# Altium schematic sheet [07] - CPU CONNECTORS .SchDoc (part 2 of 2)
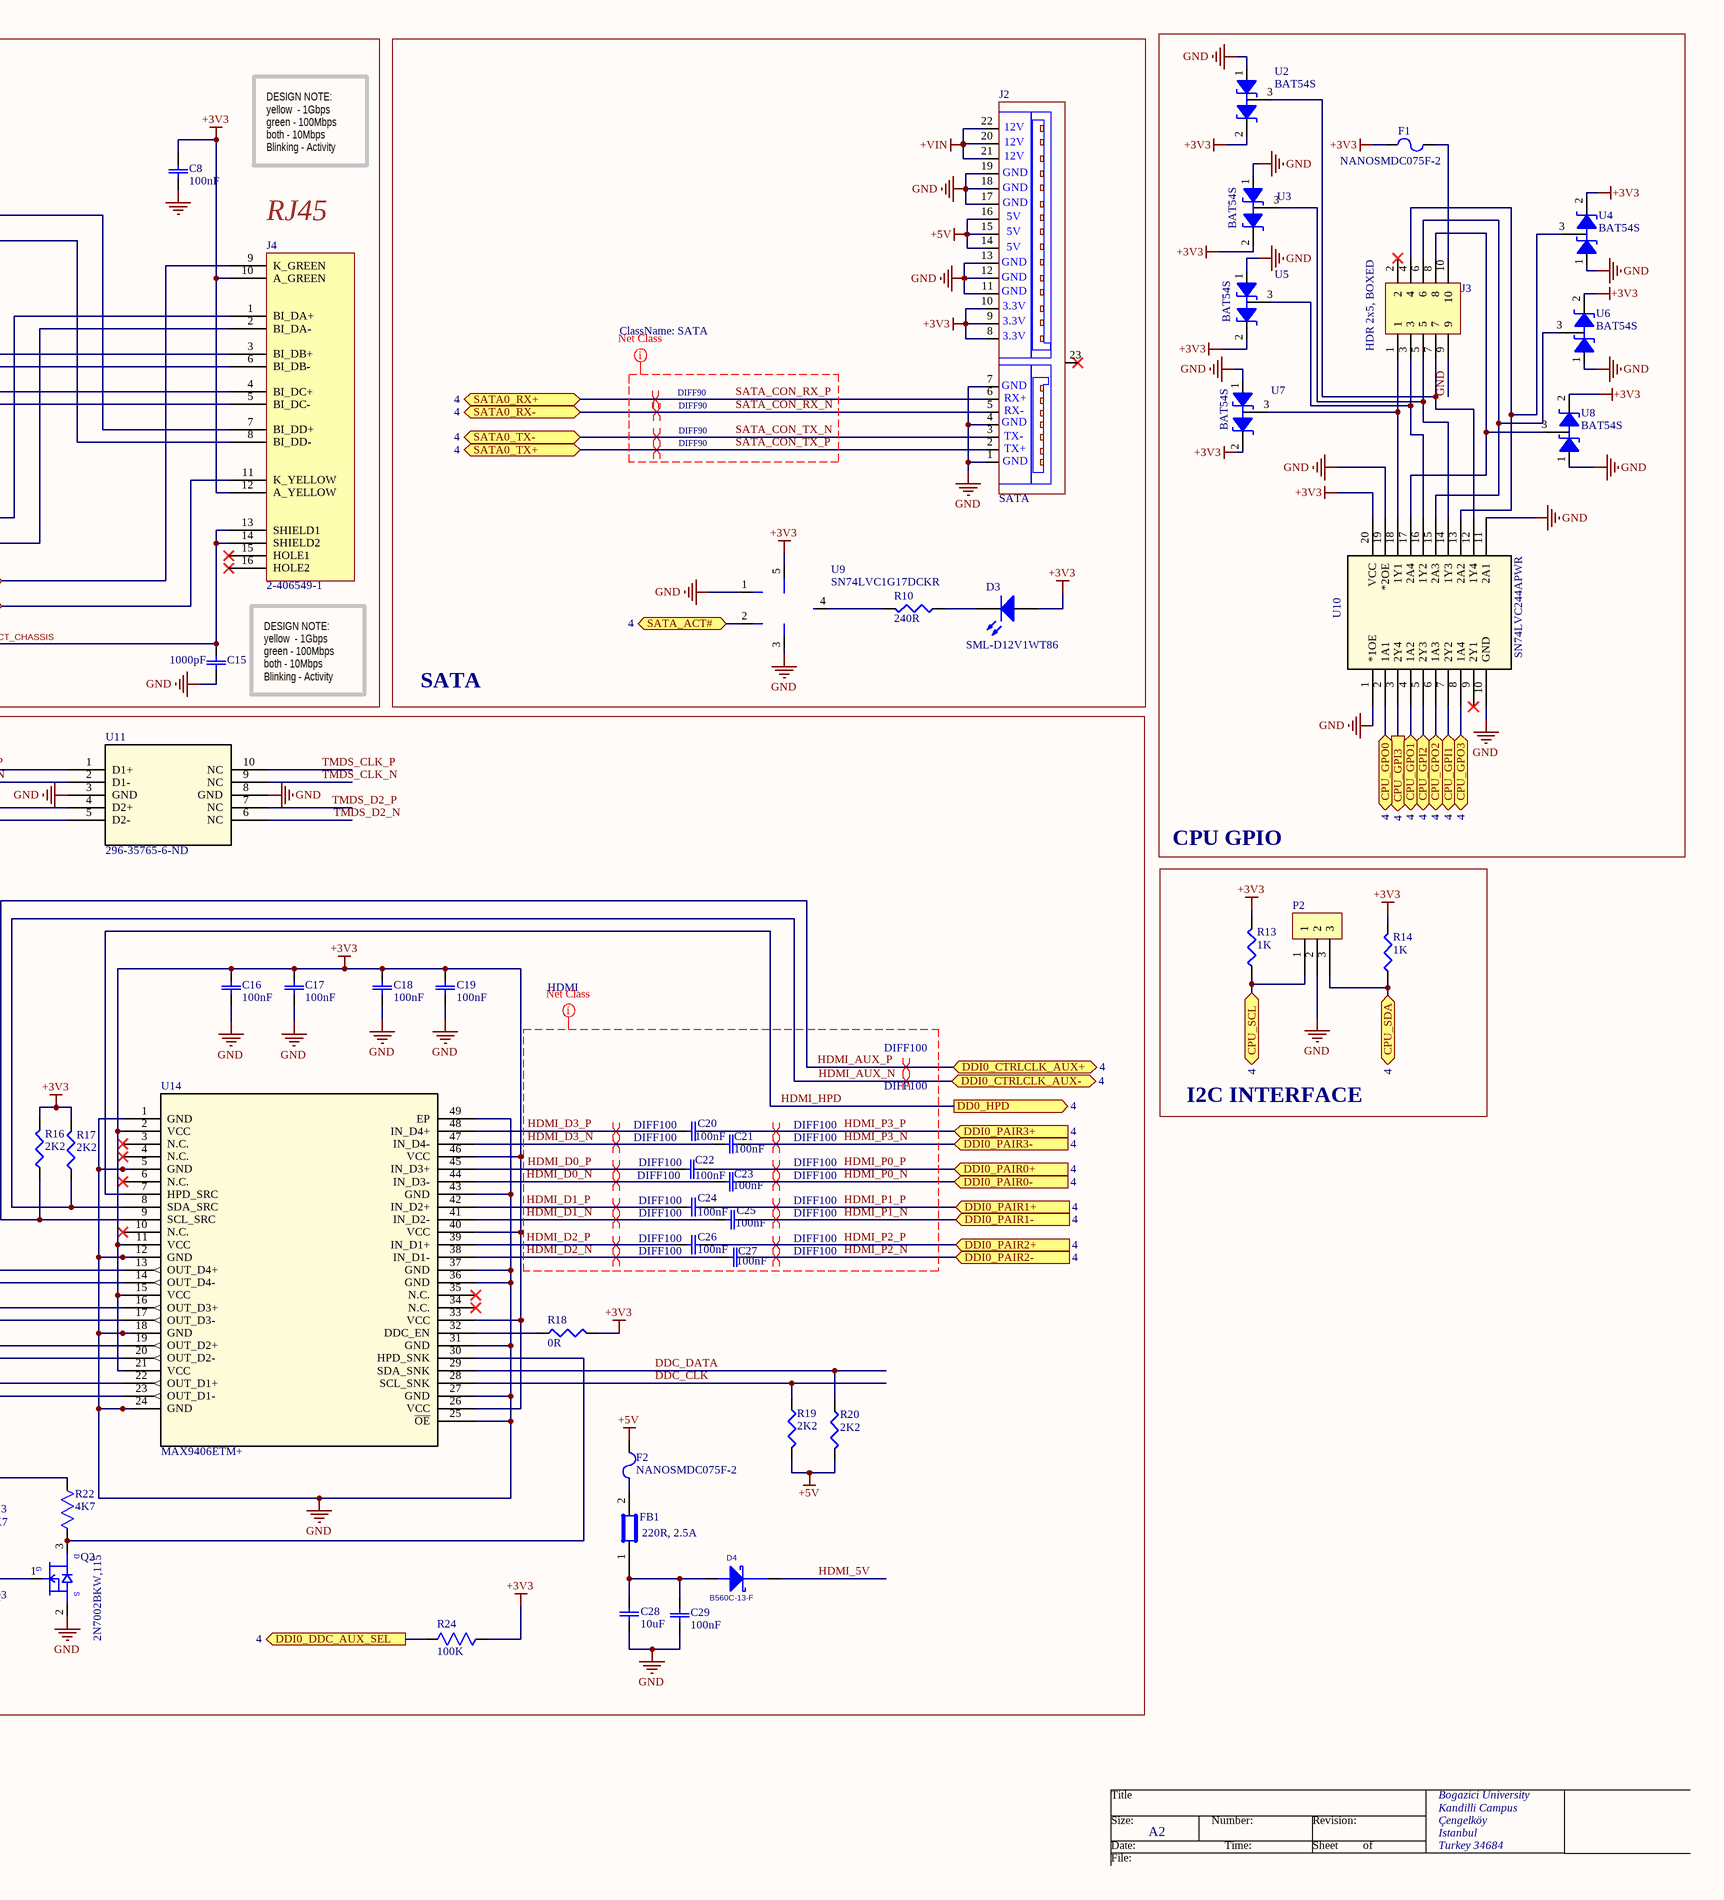
[diagram p2: [07] - CPU CONNECTORS .SchDoc, right]

## Library data of the parts
BT1 = CR2032: BATTERY HOLDER COIN 20MM PC PIN; Product Training Modules: Battery Holders for Wireless Applications; Featured Product: Top and Side Loading Coin Cell Holders Ultra-Low CR2016 Coin Cell Holder Covered 8-AA Battery Pack Cylindrical Battery Contacts; Battery Type, Function: Coin Cell, Holder; Style: Holder (Open); Number of Cells: 1; Battery Series: 2032; Online Catalog: Battery Holders, Clips, Contacts; For Use With: P188-ND / - BATTERY LITHIUM 3V COIN 20MM / P138-ND / - BATTERY LITHIUM 3V COIN 20MM / P189-ND / - BATTERY LITHIUM 3V COIN 20MM / N138-ND / - BATTERY LITHIUM 3V COIN 20MM / N188-ND / - BATTERY LITHIUM 3V COIN 20MM / P186-ND / - BATTERY LITHIUM 3V COIN 20MM / SY189-ND / - BATTERY LITHIUM 3V COIN 20MM / SY138-ND / - BATTERY LITHIUM 3V COIN 20MM / SY188-ND / - BATTERY LITHIUM 3V COIN 20MM / N189-ND / - BATTERY LITHIUM 3V COIN 20MM / P037-ND / - BATTERY LITHIUM 3V COIN 20MM / N037-ND / - BATTERY LITHIUM 3V COIN 20MM / ECR2032BP-ND / - BATTERY LITH 3V COIN 20MM; Other Names: BS7; .Checked SCH: CHK; Supplier 1: Electro Sonic; Supplier Part Number 1: BS7; Manufacturer Part Number: BS-7; Manufacturer 2: Memory Protection Devices; Manufacturer Part Number 2: BS-7; Stock 2: 0; RoHS Information: Cert of Compliance; Standard Package: 100; Family: Battery Holders, Clips, Contacts; Battery Cell Size: Coin, 20.0mm; Mounting Type: PCB, Through Hole; Termination Style: PC Pin; Height Above Board: 0.354" (9.00mm); Operating Temperature: -55°C ~ 105°C; ComponentLink1URL: http://www.memoryprotectiondevices.com/datasheets/BS-7-datasheet.pdf?src-supplier=Digi-Key; ComponentLink1Description: http://www.memoryprotectiondevices.com/datasheets/BS-7-datasheet.pdf?src-supplier=Digi-Key; Supplier 2: Perfect Parts; Supplier Part Number 2: BS-7; Description 2: BATTERY HOLDER COIN 20MM PC PIN; Category: Battery Products; .Checked PCB: CHK
C8 C13 = CL05A104KA5NNNC: CAP CER 0.1UF 50V X8R 0603; Manufacturer 1: Samsung Electro-Mechanics; Tolerance: ±10%; Voltage - Rated: 25V; Temperature Coefficient: X5R; Notification: Current market demand for these product types have resulted in fluctuating and extending lead times. Lead times may differ.; Description 1: CAP CER 0.1UF 25V X5R 0402; .Checked PCB: USED; Manufacturer Part Number 1: CL05A104KA5NNNC; RoHS: RoHS Compliant; Stock 1: 100000; Pricing 1: 1=0.1, 10=0.04, 100=0.0176, 500=0.0126, 1000=0.0099, 2500=0.009, 5000=0.00828 (USD); Packaging: Digi-Reel®; Part Status: Active; Operating Temperature: -55°C ~ 85°C; Features: -; Ratings: -; Applications: General Purpose; Mounting Type: Surface Mount, MLCC; Package / Case: 0402 (1005 Metric); Size / Dimension: 0.039" L x 0.020" W (1.00mm x 0.50mm); Height - Seated (Max): -; Thickness (Max): 0.022" (0.55mm); Lead Spacing: -; Lead Style: -; Supplier 1: Digi-Key; Supplier Part Number 1: 1276-1043-6-ND; Category: Capacitors; ComponentLink1URL: http://www.samsungsem.com/kr/support/product-search/mlcc/CL05A104KA5NNNC.jsp; ComponentLink1Description: http://www.samsungsem.com/kr/support/product-search/mlcc/CL05A104KA5NNNC.jsp; .Checked SCH: USED
C9-C12 C16-C19 = CL05A104KA5NNNC: CAP CER 0.1UF 25V X5R 0402; Manufacturer 1: Samsung Electro-Mechanics; Tolerance: ±10%; Notification: Current market demand for these product types have resulted in fluctuating and extending lead times. Lead times may differ.; .Checked SCH: CHK; Manufacturer Part Number 1: CL05A104KA5NNNC; RoHS: RoHS Compliant; Stock 1: 100000; Pricing 1: 1=0.1, 10=0.04, 100=0.0176, 500=0.0126, 1000=0.0099, 2500=0.009, 5000=0.00828 (USD); Packaging: Digi-Reel®; Part Status: Active; Voltage - Rated: 25V; Temperature Coefficient: X5R; Operating Temperature: -55°C ~ 85°C; Features: -; Ratings: -; Applications: General Purpose; Mounting Type: Surface Mount, MLCC; Package / Case: 0402 (1005 Metric); Size / Dimension: 0.039" L x 0.020" W (1.00mm x 0.50mm); Height - Seated (Max): -; Thickness (Max): 0.022" (0.55mm); Lead Spacing: -; Lead Style: -; Supplier 1: Digi-Key; Supplier Part Number 1: 1276-1043-6-ND; Description 1: CAP CER 0.1UF 25V X5R 0402; Category: Capacitors; ComponentLink1URL: http://www.samsungsem.com/kr/support/product-search/mlcc/CL05A104KA5NNNC.jsp; ComponentLink1Description: http://www.samsungsem.com/kr/support/product-search/mlcc/CL05A104KA5NNNC.jsp
C14 C15 = C1206X102KGRACAUTO: CAP CER 1206 1NF 2000V X7R 10% F; Manufacturer 1: KEMET; Voltage - Rated: 2000V (2kV); .Checked PCB: USED; Category: Capacitors; Operating Temperature: -55°C ~ 125°C; Package / Case: 1206 (3216 Metric); Supplier 1: Digi-Key; Supplier Part Number 1: 399-16730-1-ND; RoHS: RoHS Compliant; Stock 1: 7503; Pricing 1: 1=0.79, 10=0.58, 100=0.3974, 500=0.31464, 1000=0.26496 (USD); Tolerance: ±10%; Temperature Coefficient: X7R; Mounting Type: Surface Mount, MLCC; Applications: Automotive, Boardflex Sensitive; Ratings: AEC-Q200; Size / Dimension: 0.130" L x 0.063" W (3.30mm x 1.60mm); Height - Seated (Max): -; Thickness (Max): 0.073" (1.85mm); Lead Spacing: -; Features: Low ESL, Soft Termination, High Voltage; Packaging: Cut Tape (CT); Lead Style: -; ComponentLink1URL: https://api.kemet.com/component-edge/download/datasheet/C1206X102KGRACAUTO.pdf; ComponentLink1Description: https://api.kemet.com/component-edge/download/datasheet/C1206X102KGRACAUTO.pdf; Manufacturer Part Number 1: C1206X102KGRACAUTO; Part Status: Active; Failure Rate: -; Description 1: CAP CER 1206 1NF 2000V X7R 10% F; .Checked SCH: USED
C20-C27 = C1608X8R1H104K08: CAP CER 0.1UF 25V X5R 0402; Manufacturer_Part_Number: C1608X8R1H104K080AB; Manufacturer 1: TDK Corporation; Vendor: TDK; Built_By: EMA_UL_Team; Type: DEV; C: Copyright (C) 2015 Accelerated Designs. All rights reserved; Tolerance: ±10%; Voltage - Rated: 50V; Temperature Coefficient: X8R; Notification: Current market demand for these product types have resulted in fluctuating and extending lead times. Lead times may differ.; Description 1: CAP CER 0.1UF 50V X8R 0603; .Checked SCH: CHK; RefDes: RefDes; Value: Value; Manufacturer Part Number 1: C1608X8R1H104K080AB; RoHS: RoHS Compliant; Stock 1: 5228; Pricing 1: 1=0.32, 10=0.216, 100=0.1093, 500=0.07476, 1000=0.06613 (USD); Packaging: Cut Tape (CT); Part Status: Active; Operating Temperature: -55°C ~ 150°C; Features: High Temperature; Ratings: -; Applications: General Purpose; Failure Rate: -; Mounting Type: Surface Mount, MLCC; Package / Case: 0603 (1608 Metric); Size / Dimension: 0.063" L x 0.032" W (1.60mm x 0.80mm); Height - Seated (Max): -; Thickness (Max): 0.035" (0.90mm); Lead Spacing: -; Lead Style: -; Supplier 1: Digi-Key; Supplier Part Number 1: 445-8818-1-ND; Category: Capacitors
C28 = C3216JB1V106K160: CAP CER 10UF 35V JB 1206; Manufacturer_Part_Number: C3216JB1V106K160AB; Manufacturer 1: TDK Corporation; Tolerance: ±10%; Vendor: TDK; Built_By: EMA_UL_Team; Type: DEV; C: Copyright (C) 2015 Accelerated Designs. All rights reserved; Notification: Current market demand for these product types have resulted in fluctuating and extending lead times. Lead times may differ.; .Checked SCH: CHK; Category: Capacitors; Operating Temperature: -25°C ~ 85°C; Package / Case: 1206 (3216 Metric); Value: Value; Voltage - Rated: 35V; Features: Low ESL; Supplier 1: Digi-Key; Supplier Part Number 1: 445-11736-1-ND; RoHS: RoHS Compliant; Stock 1: 5285; Pricing 1: 1=0.92, 10=0.648, 100=0.4269, 500=0.31626, 1000=0.26881 (USD); Temperature Coefficient: JB; Mounting Type: Surface Mount, MLCC; Applications: General Purpose; Ratings: -; Size / Dimension: 0.126" L x 0.063" W (3.20mm x 1.60mm); Height - Seated (Max): -; Thickness (Max): 0.069" (1.75mm); Lead Spacing: -; Packaging: Cut Tape (CT); Lead Style: -; ComponentLink1URL: https://product.tdk.com/info/en/catalog/datasheets/mlcc_commercial_general_en.pdf; ComponentLink1Description: https://product.tdk.com/info/en/catalog/datasheets/mlcc_commercial_general_en.pdf; RefDes: RefDes; Manufacturer Part Number 1: C3216JB1V106K160AB; Part Status: Active; Failure Rate: -; Description 1: CAP CER 10UF 35V JB 1206
C29 = CL05A104KA5NNNC: CAP CER 0.1UF 50V X8R 0603; Manufacturer 1: Samsung Electro-Mechanics; Voltage - Rated: 25V; Tolerance: ±10%; Temperature Coefficient: X5R; Notification: Current market demand for these product types have resulted in fluctuating and extending lead times. Lead times may differ.; Description 1: CAP CER 0.1UF 25V X5R 0402; .Checked SCH: CHK; Category: Capacitors; Operating Temperature: -55°C ~ 85°C; Package / Case: 0402 (1005 Metric); Supplier 1: Digi-Key; Supplier Part Number 1: 1276-1043-6-ND; RoHS: RoHS Compliant; Stock 1: 100000; Pricing 1: 1=0.1, 10=0.04, 100=0.0176, 500=0.0126, 1000=0.0099, 2500=0.009, 5000=0.00828 (USD); Mounting Type: Surface Mount, MLCC; Applications: General Purpose; Ratings: -; Size / Dimension: 0.039" L x 0.020" W (1.00mm x 0.50mm); Height - Seated (Max): -; Thickness (Max): 0.022" (0.55mm); Lead Spacing: -; Features: -; Packaging: Digi-Reel®; Lead Style: -; ComponentLink1URL: http://www.samsungsem.com/kr/support/product-search/mlcc/CL05A104KA5NNNC.jsp; ComponentLink1Description: http://www.samsungsem.com/kr/support/product-search/mlcc/CL05A104KA5NNNC.jsp; Manufacturer Part Number 1: CL05A104KA5NNNC; Part Status: Active
D3 = SML-D12V1WT86: LED RED DIFFUSED 1608 SMD; Manufacturer 1: Rohm Semiconductor; Lens Color: White; Millicandela Rating: 40mcd; Lens Style/Size: Rectangle with Flat Top, 1.20mm x 0.80mm; Voltage - Forward (Vf) (Typ): 2.2V; Current - Test: 20mA; Wavelength - Dominant: 630nm; .Checked SCH: CHK; Manufacturer Part Number 1: SML-D12V1WT86; Stock 1: 3000; Pricing 1: 3000=0.0245, 6000=0.023, 12000=0.0217, 18000=0.0205, 30000=0.0199 (USD); Family: LED Indication - Discrete; Series: SML-D12; Packaging: Tape & Reel (TR); Color: Red; Lens Transparency: Diffused; Viewing Angle: -; Mounting Type: Surface Mount; Wavelength - Peak: -; Features: -; Package / Case: 0603 (1608 Metric); Supplier Device Package: 1608 (0603); Size / Dimension: 1.60mm L x 0.80mm W; Height (Max): 0.65mm; ComponentLink1URL: http://www.rohm.com/web/global/datasheet/SML-D12V1W?src-supplier=Digi-Key; ComponentLink1Description: http://www.rohm.com/web/global/datasheet/SML-D12V1W?src-supplier=Digi-Key; ComponentLink2URL: https://www.rohm.com/datasheet/SML-D12V1W?src-supplier=Digi-Key; ComponentLink2Description: https://www.rohm.com/datasheet/SML-D12V1W?src-supplier=Digi-Key; Supplier 1: Avnet; Supplier Part Number 1: SML-D12V1WT86; Description 1: LED RED DIFFUSED 1608 SMD; Category: Optoelectronics; .Checked PCB: CHK
D4 = B560C-13-F: DIODE SCHOTTKY 60V 5A SMC; Manufacturer: Diodes Inc; .Checked SCH: CHK; Voltage - Forward (Vf) (Max) @ If: 700mV @ 5A; Speed: Fast Recovery =< 500ns, > 200mA (Io); Current - Reverse Leakage @ Vr: 500µA @ 60V; Capacitance @ Vr, F: 300pF @ 4V, 1MHz; Category: Discrete Semiconductor Products; Supplier Part Number: B560C-FDICT-ND; Manufacturer Part Number: B560C-13-F; Price 1k [$]: 0.42900; Value: B560C-13-F; Package / Case: DO-214AB, SMC; Supplier: Digikey; Family: Diodes, Rectifiers - Single; Voltage - DC Reverse (Vr) (Max): 60V; Current - Average Rectified (Io): 5A; Diode Type: Schottky; Supplier 1: Digi-Key; Supplier Part Number 1: B560C-FDICT-ND; RoHS: RoHS Compliant; Stock 1: 37770; Pricing 1: 1=0.99, 10=0.884, 100=0.702, 250=0.611, 500=0.546, 1000=0.429 (USD); Reverse Recovery Time (trr): -; Mounting Type: Surface Mount; Supplier Device Package: SMC; Packaging: Cut Tape (CT); ComponentLink1URL: http://www.diodes.com/datasheets/ds13012.pdf; ComponentLink1Description: http://www.diodes.com/datasheets/ds13012.pdf
F1 = NANOSMDC075F-2: PTC RESET FUSE 6V 750MA 1206; Manufacturer 1: Littelfuse Inc.; Vendor: TE Connectivity; Built_By: EMA_UL_Team; Type: DEV; C: Copyright (C) 2015 Accelerated Designs. All rights reserved; Approvals: CSA, TUV, UL; .Checked PCB: USED; Manufacturer_Part_Number: NANOSMDC075F-2; RefDes: RefDes; Value: Value; Manufacturer Part Number 1: NANOSMDC075F-2; RoHS: RoHS Compliant; Stock 1: 13379; Pricing 1: 1=0.54, 5=0.528, 10=0.512, 50=0.4306, 100=0.3575, 250=0.325, 500=0.27626, 1000=0.24375 (USD); Packaging: Cut Tape (CT); Part Status: Active; Voltage - Max: 6V; Operating Temperature: -40°C ~ 85°C; Ratings: -; Mounting Type: Surface Mount; Package / Case: 1206 (3216 Metric), Concave; Size / Dimension: 0.126" L x 0.063" W (3.20mm x 1.59mm); Height - Seated (Max): -; Thickness (Max): 0.027" (0.68mm); Lead Spacing: -; ComponentLink1URL: http://www.littelfuse.com/~/media/electronics/product_specifications/resettable_ptcs/littelfuse_ptc_nanosmdc075f_2_product_specification.pdf.pdf; ComponentLink1Description: http://www.littelfuse.com/~/media/electronics/product_specifications/resettable_ptcs/littelfuse_ptc_nanosmdc075f_2_product_specification.pdf.pdf; Supplier 1: Digi-Key; Supplier Part Number 1: NANOSMDC075F-2CT-ND; Description 1: PTC RESET FUSE 6V 750MA 1206; Category: Circuit Protection; .Checked SCH: USED
F2 = NANOSMDC075F-2: PTC RESET FUSE 6V 750MA 1206; Manufacturer 1: Littelfuse Inc.; Vendor: TE Connectivity; Built_By: EMA_UL_Team; Type: DEV; C: Copyright (C) 2015 Accelerated Designs. All rights reserved; Approvals: CSA, TUV, UL; Manufacturer_Part_Number: NANOSMDC075F-2; RefDes: RefDes; Value: Value; Manufacturer Part Number 1: NANOSMDC075F-2; RoHS: RoHS Compliant; Stock 1: 13379; Pricing 1: 1=0.54, 5=0.528, 10=0.512, 50=0.4306, 100=0.3575, 250=0.325, 500=0.27626, 1000=0.24375 (USD); Packaging: Cut Tape (CT); Part Status: Active; Voltage - Max: 6V; Operating Temperature: -40°C ~ 85°C; Ratings: -; Mounting Type: Surface Mount; Package / Case: 1206 (3216 Metric), Concave; Size / Dimension: 0.126" L x 0.063" W (3.20mm x 1.59mm); Height - Seated (Max): -; Thickness (Max): 0.027" (0.68mm); Lead Spacing: -; ComponentLink1URL: http://www.littelfuse.com/~/media/electronics/product_specifications/resettable_ptcs/littelfuse_ptc_nanosmdc075f_2_product_specification.pdf.pdf; ComponentLink1Description: http://www.littelfuse.com/~/media/electronics/product_specifications/resettable_ptcs/littelfuse_ptc_nanosmdc075f_2_product_specification.pdf.pdf; Supplier 1: Digi-Key; Supplier Part Number 1: NANOSMDC075F-2CT-ND; Description 1: PTC RESET FUSE 6V 750MA 1206; Category: Circuit Protection
FB1 = BLM18SG221TN1D: FERRITE CHIP 220 OHM 2500MA 0603; Manufacturer: Murata Electronics North America; Impedance @ Frequency: 220 Ohm @ 100MHz; DC Resistance (DCR): 40 mOhm Max; Filter Type: Differential Mode - Single; Number of Lines: 1; .Checked SCH: CHK; Supplier 1: Digi-Key; Supplier Part Number 1: 490-5225-1-ND; Manufacturer Part Number: BLM18SG221TN1D; RoHS: RoHS Compliant; Category: Filters; Stock 1: 54640; Pricing 1: 1=0.38, 10=0.282, 50=0.1646, 100=0.1316, 250=0.094, 500=0.06392, 1000=0.0517, 5000=0.04042 (USD); Current Rating: 2.5A; Package / Case: 0603 (1608 Metric); Mounting Type: Surface Mount; Packaging: Cut Tape (CT); Height (Max): 0.037" (0.95mm); Size / Dimension: 0.063" L x 0.031" W (1.60mm x 0.80mm); ComponentLink1URL: http://search.murata.co.jp/Ceramy/image/img/PDF/ENG/L0110S0100BLM18S.pdf; ComponentLink1Description: http://search.murata.co.jp/Ceramy/image/img/PDF/ENG/L0110S0100BLM18S.pdf
J2 = SATA: CONN SATA RECEPT 22POS SMD R/A; Manufacturer 1: Molex, LLC; Manufacturer Part Number 1: 0470182000; Connector Style: Receptacle; Number of Positions: 22; .Checked PCB: USED; RoHS: RoHS Compliant; Stock 1: 2490; Pricing 1: 1=6.29, 10=6.028, 25=5.5036, 50=5.2414, 100=4.9793, 250=4.4552, 500=4.19312, 1000=3.66898, 2500=3.48553 (USD); Packaging: Tray; Part Status: Active; Connector Type: SATA; Mounting Type: Surface Mount, Right Angle; Termination: Solder; Features: Board Lock; Contact Finish: Gold; Contact Finish Thickness: Flash; ComponentLink1URL: https://www.molex.com/pdm_docs/sd/470182000_sd.pdf; ComponentLink1Description: https://www.molex.com/pdm_docs/sd/470182000_sd.pdf; Supplier 1: Digi-Key; Supplier Part Number 1: WM4050-ND; Description 1: CONN SATA RECEPT 22POS SMD R/A; Category: Connectors, Interconnects; .Checked SCH: USED
J3 = D2510-6002-AR: CONN HEADER 10POS VERT 10GOLD; Manufacturer: 3M; Connector Type: Header, Shrouded; Number of Positions: 10; Number of Positions Loaded: All; Pitch: 0.100" (2.54mm); .Creator: MM; .Checked PCB: USED; Supplier 1: Digi-Key; Manufacturer Part Number: D2510-6002-AR; RoHS: RoHS Compliant; Category: Connectors, Interconnects; Stock 1: 1080; Pricing 1: 1=1.57, 10=1.421, 50=1.276, 100=1.218, 250=1.102, 500=1.015, 1000=0.87, 2500=0.812, 5000=0.7714 (USD); Packaging: Bulk; Contact Type: Male Pin; Number of Rows: 2; Row Spacing: 0.100" (2.54mm); Contact Mating Length: 0.243" (6.17mm); Mounting Type: Through Hole; Termination: Solder; Fastening Type: -; Features: -; Contact Finish: Gold; Contact Finish Thickness: 10µin (0.25µm); Color: Black; ComponentLink1URL: http://multimedia.3m.com/mws/mediawebserver?66666UuZjcFSLXTtm8T_oxMcEVuQEcuZgVs6EVs6E666666--; ComponentLink1Description: http://multimedia.3m.com/mws/mediawebserver?66666UuZjcFSLXTtm8T_oxMcEVuQEcuZgVs6EVs6E666666--; Supplier Part Number 1: MHC10E-ND; .Checked SCH: USED
J4 = 2-406549-1: CONN MOD JACK 8POS R/A G-Y PCB; Manufacturer: Tyco; .Checked PCB: USED; Number of Positions: 8p8c (RJ45, Ethernet); Number of Ports: 1; Shielding: Shielded, EMI Finger; Ratings: Cat5; LED Color: Yellow - Green; Tab Direction: Up; .Checked SCH: USED; Category: Connectors, Interconnects; Connector Type: Jack; Manufacturer Part Number: 2-406549-1; Price 1k [$]: 1.73278; Supplier: Digikey; Supplier Part Number: A97715-ND; Value: 2-406549-1; Supplier 1: Digi-Key; Supplier Part Number 1: A97715-ND; RoHS: RoHS Compliant; Stock 1: 9021; Pricing 1: 1=3.42 (USD); Number of Positions/Contacts: 8p8c (RJ45, Ethernet); Number of Rows: 1; Mounting Type: Through Hole; Orientation: 90° Angle (Right); Termination: Solder; Features: Board Lock; Packaging: Tray; Housing Material: Thermoplastic; Contact Material: Phosphor Bronze; Contact Finish: Gold; Operating Temperature: -40°C ~ 85°C; ComponentLink1URL: http://documents.tycoelectronics.com/commerce/DocumentDelivery/DDEController?Action=srchrtrv&DocNm=406549&DocType=CD&DocLang=EN; ComponentLink1Description: http://documents.tycoelectronics.com/commerce/DocumentDelivery/DDEController?Action=srchrtrv&DocNm=406549&DocType=CD&DocLang=EN
J5 = 47151-0001: CONN RCPT 19POS HDMI RT ANG SMD; Manufacturer: Molex Connector Corporation; .Checked SCH: CHK; Number of Positions: 19; Pitch: 0.50mm (.020"); Gender: Receptacle; Category: Connectors, Interconnects; Connector Type: HDMI; Family: USB, IEEE-1394 (Firewire), DVI, HDMI; Manufacturer Part Number: 47151-0001; Operating Temperature: -20°C to +85°C; Price 1k [$]: 1.74610; Supplier: Digikey; Supplier Part Number: WM19086CT-ND; Value: 47151-0001; Supplier 1: Digi-Key; Supplier Part Number 1: WM19086CT-ND; RoHS: RoHS Compliant; Stock 1: 2756; Pricing 1: 1=3.1, 10=2.57, 50=2.1456, 100=1.9034 (USD); Number of Contacts: 19; Specifications: -; Mounting Type: Surface Mount, Right Angle, Horizontal; Features: Detent Lock; Packaging: Cut Tape (CT); Ingress Protection: -; ComponentLink1URL: http://www.molex.com/pdm_docs/sd/471510001_sd.pdf; ComponentLink1Description: http://www.molex.com/pdm_docs/sd/471510001_sd.pdf
LS1 = GT-0903A: AUDIO MAGNETIC XDCR 2-4V TH; Manufacturer 1: Soberton Inc.; Driver Circuitry: Transducer, Externally Driven; Input Type: Zero-Peak Signal; Voltage Range: 2 ~ 4V; Frequency: 2.73kHz; Operating Mode: Single Tone; Sound Pressure Level (SPL): 85dB @ 3V, 10cm; Current - Supply: 80mA; Port Location: Top; .Checked SCH: USED; Supplier 1: Digi-Key; Supplier Part Number 1: 433-1032-ND; Manufacturer Part Number 1: GT-0903A; RoHS: RoHS Compliant; Description 1: AUDIO MAGNETIC XDCR 2-4V TH; Category: Audio Products; Stock 1: 13944; Pricing 1: 1=0.97, 10=0.774, 25=0.7036, 50=0.658, 100=0.6125, 250=0.56, 500=0.5215, 1000=0.4865, 5000=0.4375 (USD); Packaging: Tray; Part Status: Active; Technology: Magnetic; Duration: -; Operating Temperature: -20°C ~ 60°C; Approvals: -; Ratings: -; Mounting Type: Through Hole; Termination: PC Pins; Size / Dimension: 0.354" Dia (9.00mm); Height - Seated (Max): 0.197" (5.00mm); ComponentLink1URL: http://cirlw3yrzg4afc1x47lv2k18.wpengine.netdna-cdn.com/wp-content/uploads/2016/10/GT-0903A-Rev.A_2016-1.pdf; ComponentLink1Description: http://cirlw3yrzg4afc1x47lv2k18.wpengine.netdna-cdn.com/wp-content/uploads/2016/10/GT-0903A-Rev.A_2016-1.pdf
P2 = 76384-303LF: CONN HEADER 3POS .100" STR GOLD; Manufacturer: FCI; Connector Type: Header, Shrouded; Number of Positions: 3; Number of Positions Loaded: All; Pitch: 0.100" (2.54mm); .Creator: MM; .Checked PCB: CHK; Supplier 1: Digi-Key; Manufacturer Part Number: 76384-303LF; RoHS: RoHS Compliant; Category: Connectors, Interconnects; Stock 1: 1441; Pricing 1: 1=0.59, 10=0.556, 25=0.5, 50=0.4444, 100=0.426, 250=0.38892, 500=0.3704, 1000=0.30558, 2500=0.2778 (USD); Packaging: Tube; Contact Type: Male Pin; Number of Rows: 1; Row Spacing: -; Contact Mating Length: 0.197" (5.00mm); Mounting Type: Through Hole; Termination: Solder; Fastening Type: Friction Lock; Features: -; Contact Finish: Gold, GXT™; Contact Finish Thickness: 30µin (0.76µm); Color: Black; ComponentLink1URL: http://portal.fciconnect.com/Comergent//fci/drawing/76384.pdf; ComponentLink1Description: http://portal.fciconnect.com/Comergent//fci/drawing/76384.pdf; Supplier Part Number 1: 609-1305-ND; .Checked SCH: CHK
Q1 = DMG1012UW-7: Manufacturer 1: Diodes Incorporated; Note: Pin 2 is electrically connected to pin 4.; .Checked SCH: USED; FET Type: N-Channel; Current - Continuous Drain (Id) @ 25°C: 1A (Ta); Drive Voltage (Max Rds On,  Min Rds On): 1.8V, 4.5V; Rds On (Max) @ Id, Vgs: 450 mOhm @ 600mA, 4.5V; Vgs(th) (Max) @ Id: 1V @ 250µA; Vgs (Max): ±6V; Power Dissipation (Max): 290mW (Ta); Published: 8-Jun-2000; LatestRevisionDate: 17-Jul-2002; LatestRevisionNote: Re-released for DXP Platform.; DatasheetVersion: PD-9.814; PackageReference: TO-220AB; Publisher: Altium Limited; Code_JEDEC: TO-220-AB; ComponentLink1Description: Manufacturer Link; ComponentLink1URL: http://www.irf.com/; Digikey P/N: DMG1012UW-7DITR-ND; Supplier 1: Digi-Key; Supplier Part Number 1: DMG1012UW-7DICT-ND; Manufacturer Part Number 1: DMG1012UW-7; RoHS: RoHS Compliant; Description 1: MOSFET N-CH 20V 1A SOT323; Category: Discrete Semiconductor Products; Stock 1: 211076; Pricing 1: 1=0.41, 10=0.37, 100=0.2074, 500=0.1111, 1000=0.07554 (USD); Packaging: Cut Tape (CT); Part Status: Active; Technology: MOSFET (Metal Oxide); FET Feature: -; Operating Temperature: -55°C ~ 150°C (TJ); Mounting Type: Surface Mount; Supplier Device Package: SOT-323; Package / Case: SC-70, SOT-323; ComponentLink2URL: https://www.diodes.com/assets/Datasheets/ds31859.pdf; ComponentLink2Description: https://www.diodes.com/assets/Datasheets/ds31859.pdf
Q2 Q3 = 2N7002BKW,115: MOSFET N-CH 60V 310MA SOT323; Manufacturer: NXP Semiconductors; FET Type: MOSFET N-Channel, Metal Oxide; FET Feature: Logic Level Gate; Rds On (Max) @ Id, Vgs: 1.6 Ohm @ 500mA, 10V; Vgs(th) (Max) @ Id: 2.1V @ 250µA; Gate Charge (Qg) @ Vgs: 0.6nC @ 4.5V; Input Capacitance (Ciss) @ Vds: 50pF @ 10V; Power - Max: 275mW; .Checked SCH: CHK; Supplier 1: Digi-Key; Supplier Part Number 1: 568-5980-1-ND; Manufacturer Part Number: 2N7002BKW,115; RoHS: RoHS Compliant; Category: Discrete Semiconductor Products; Stock 1: 15666; Pricing 1: 1=0.39, 10=0.354, 25=0.2548, 100=0.1983, 250=0.12456, 500=0.10616, 1000=0.07233 (USD); Drain to Source Voltage (Vdss): 60V; Current - Continuous Drain (Id) @ 25° C: 310mA; Mounting Type: Surface Mount; Package / Case: SC-70, SOT-323; Supplier Device Package: SC-70; Packaging: Cut Tape (CT); ComponentLink1URL: http://www.nxp.com/documents/data_sheet/2N7002BKW.pdf; ComponentLink1Description: http://www.nxp.com/documents/data_sheet/2N7002BKW.pdf
R6-R9 = RC1005F750CS: RES SMD 75 OHM 1% 1/16W 0402; Manufacturer 1: Samsung Electro-Mechanics; Power (Watts): 0.063W, 1/16W; .Checked PCB: USED; Temperature Coefficient: ±100ppm/°C; Category: Resistors; Package / Case: 0402 (1005 Metric); Tolerance: ±1%; .Checked SCH: USED; Supplier 1: Digi-Key; Supplier Part Number 1: 1276-3476-6-ND; RoHS: RoHS Compliant; Stock 1: 924150; Pricing 1: 1=0.1, 10=0.021, 100=0.0087, 1000=0.00391, 2500=0.00339, 5000=0.0028 (USD); Composition: Thick Film; Features: Moisture Resistant; Size / Dimension: 0.039" L x 0.020" W (1.00mm x 0.50mm); Packaging: Digi-Reel®; ComponentLink1URL: http://www.samsungsem.com/kr/support/product-search/chip-resistor/RC1005F750CS.jsp; ComponentLink1Description: http://www.samsungsem.com/kr/support/product-search/chip-resistor/RC1005F750CS.jsp; Manufacturer Part Number 1: RC1005F750CS; Part Status: Active; Operating Temperature: -55°C ~ 155°C; Supplier Device Package: 0402; Height - Seated (Max): 0.016" (0.40mm); Failure Rate: -; Description 1: RES SMD 75 OHM 1% 1/16W 0402
R10 = RMCF0402FT240R: RES TF 240 OHM 1% 0.0625W 0402; Manufacturer: Stackpole Electronics Inc; Resistance (Ohms): 240; Power (Watts): 0.063W, 1/16W; .Checked PCB: USED; Temperature Coefficient: ±100ppm/°C; Category: Resistors; Supplier Part Number: RMCF0402FT240RCT-ND; Manufacturer Part Number: RMCF0402FT240R; Package / Case: 0402 (1005 Metric); Price 1k [$]: 0.00384; Tolerance: ±1%; Value: 240R; .Checked SCH: USED; Supplier: Digikey; Supplier 1: Digi-Key; Supplier Part Number 1: RMCF0402FT240RCT-ND; RoHS: RoHS Compliant; Stock 1: 39860; Pricing 1: 1=0.04, 10=0.025, 50=0.0138, 100=0.0105, 250=0.0078, 500=0.00576, 1000=0.00384 (USD); Composition: Thick Film; Features: -; Size / Dimension: 0.039" L x 0.020" W (1.00mm x 0.50mm); Height: 0.016" (0.40mm); Number of Terminations: 2; Packaging: Cut Tape (CT); ComponentLink1URL: http://www.seielect.com/Catalog/SEI-RMCF.pdf; ComponentLink1Description: http://www.seielect.com/Catalog/SEI-RMCF.pdf
R11 = ERJ-2RKF33R0X: RES SMD 33 OHM 1% 1/10W 0402; Manufacturer 1: Panasonic Electronic Components; .Checked SCH: CHK; Power (Watts): 0.1W, 1/10W; Temperature Coefficient: ±100ppm/°C; Manufacturer Part Number 1: ERJ-2RKF33R0X; RoHS: RoHS Compliant; Stock 1: 459707; Pricing 1: 1=0.1, 10=0.056, 100=0.0227, 1000=0.01021, 2500=0.00886, 5000=0.00732 (USD); Packaging: Digi-Reel®; Part Status: Active; Tolerance: ±1%; Composition: Thick Film; Features: Automotive AEC-Q200; Operating Temperature: -55°C ~ 155°C; Package / Case: 0402 (1005 Metric); Supplier Device Package: 0402; Size / Dimension: 0.039" L x 0.020" W (1.00mm x 0.50mm); Height - Seated (Max): 0.016" (0.40mm); Failure Rate: -; ComponentLink1URL: https://industrial.panasonic.com/cdbs/www-data/pdf/RDA0000/AOA0000C304.pdf; ComponentLink1Description: https://industrial.panasonic.com/cdbs/www-data/pdf/RDA0000/AOA0000C304.pdf; Supplier 1: Digi-Key; Supplier Part Number 1: P33.0LDKR-ND; Description 1: RES SMD 33 OHM 1% 1/10W 0402; Category: Resistors
R12 = RC0402JR-07100RL: RES SMD 100 OHM 5% 1/16W 0402; Manufacturer 1: Yageo; .Checked PCB: used; Resistance: 100 Ohms; Power Rating: 62.5 mW (1/16 W); Temperature Coefficient: 100 PPM / C; Voltage Rating: 50 V; Unit Weight: 0.000023 oz; .Checked SCH: used; Manufacturer Part Number 1: RC0402JR-07100RL; Stock 1: 1979840; Pricing 1: 1=0.098, 500=0.004, 1500=0.0023, 2500=0.0017, 5000=0.0012 (USD); Product Category: Thick Film Resistors; RoHS: True; Brand: Yageo; Tolerance: 5 %; Case Code - in: 0402; Case Code - mm: 1005; Operating Temperature Range: - 55 C to + 155 C; Series: RC; Height: 0.35 mm; Length: 1 mm; Package / Case: 0402 (1005 metric); Packaging: Reel; Product: Thick Film Resistors General Purpose; Termination Style: SMD/SMT; Type: General Purpose Chip Resistor Surface Mount; Width: 0.5 mm; ComponentLink1URL: http://www.farnell.com/datasheets/2167052.pdf?src-supplier=Element14; ComponentLink1Description: http://www.farnell.com/datasheets/2167052.pdf?src-supplier=Element14; ComponentLink2URL: http://www.yageo.com/documents/recent/PYu-RC_Group_51_RoHS_L_10.pdf?src-supplier=Digi-Key; ComponentLink2Description: http://www.yageo.com/documents/recent/PYu-RC_Group_51_RoHS_L_10.pdf?src-supplier=Digi-Key; ComponentLink3URL: http://www.yageo.com/documents/recent/PYu-RC_Group_51_RoHS_L_9.pdf?src-supplier=Digi-Key; ComponentLink3Description: http://www.yageo.com/documents/recent/PYu-RC_Group_51_RoHS_L_9.pdf?src-supplier=Digi-Key; ComponentLink4URL: http://www.yageo.com/documents/recent/PYu-RC0402_51_RoHS_L_6_r.pdf?src-supplier=Future+Electronics; ComponentLink4Description: http://www.yageo.com/documents/recent/PYu-RC0402_51_RoHS_L_6_r.pdf?src-supplier=Future+Electronics; ComponentLink5URL: http://www.mouser.com/ds/2/447/PYu-RC0402_51_RoHS_L_6_r-8721.pdf?src-supplier=Mouser; ComponentLink5Description: http://www.mouser.com/ds/2/447/PYu-RC0402_51_RoHS_L_6_r-8721.pdf?src-supplier=Mouser; ComponentLink6URL: http://www.farnell.com/datasheets/1018594.pdf?src-supplier=Element14; ComponentLink6Description: http://www.farnell.com/datasheets/1018594.pdf?src-supplier=Element14; Supplier 1: Future Electronics; Supplier Part Number 1: RC0402JR-07100RL-CUTT; Description 1: RES SMD 100 OHM 5% 1/16W 0402; Value: 100R
R13 R14 = ERJ-2RKF1001X: RES SMD 1K OHM 1% 1/10W 0402; Manufacturer 1: Panasonic Electronic Components; Power (Watts): 0.1W, 1/10W; .Checked PCB: used; Temperature Coefficient: ±100ppm/°C; Category: Resistors; Package / Case: 0402 (1005 Metric); Tolerance: ±1%; .Checked SCH: used; Supplier 1: Digi-Key; Supplier Part Number 1: P1.00KLDKR-ND; RoHS: RoHS Compliant; Stock 1: 18630560; Pricing 1: 1=0.1, 10=0.056, 100=0.0227, 1000=0.01021, 2500=0.00886, 5000=0.00732 (USD); Composition: Thick Film; Features: Automotive AEC-Q200; Size / Dimension: 0.039" L x 0.020" W (1.00mm x 0.50mm); Packaging: Digi-Reel®; ComponentLink1URL: https://industrial.panasonic.com/cdbs/www-data/pdf/RDA0000/AOA0000C304.pdf; ComponentLink1Description: https://industrial.panasonic.com/cdbs/www-data/pdf/RDA0000/AOA0000C304.pdf; Manufacturer Part Number 1: ERJ-2RKF1001X; Part Status: Active; Operating Temperature: -55°C ~ 155°C; Supplier Device Package: 0402; Height - Seated (Max): 0.016" (0.40mm); Failure Rate: -; Description 1: RES SMD 1K OHM 1% 1/10W 0402
R15 = CRGCQ0402J470R: RES 470 OHM 1/16W 5% 0402 SMD; .Checked SCH: CHK; Manufacturer Part Number: CRGCQ0402J470R; Supplier Part Number: A130046CT-ND
R16 R17 = RC1005F222CS: RES SMD 2.2K OHM 1% 1/16W 0402; Manufacturer 1: Samsung Electro-Mechanics; Power (Watts): 0.063W, 1/16W; Temperature Coefficient: ±100ppm/°C; Category: Resistors; Package / Case: 0402 (1005 Metric); Tolerance: ±1%; Supplier 1: Digi-Key; Supplier Part Number 1: 1276-4046-6-ND; RoHS: RoHS Compliant; Stock 1: 956467; Pricing 1: 1=0.1, 10=0.021, 100=0.0087, 1000=0.00391, 2500=0.00339, 5000=0.0028 (USD); Composition: Thick Film; Features: Moisture Resistant; Size / Dimension: 0.039" L x 0.020" W (1.00mm x 0.50mm); Packaging: Digi-Reel®; ComponentLink1URL: http://www.samsungsem.com/kr/support/product-search/chip-resistor/RC1005F222CS.jsp; ComponentLink1Description: http://www.samsungsem.com/kr/support/product-search/chip-resistor/RC1005F222CS.jsp; Manufacturer Part Number 1: RC1005F222CS; Part Status: Active; Operating Temperature: -55°C ~ 155°C; Supplier Device Package: 0402; Height - Seated (Max): 0.016" (0.40mm); Failure Rate: -; Description 1: RES SMD 2.2K OHM 1% 1/16W 0402
R18 = RC1005J000CS: RES SMD 0 OHM JUMPER 1/16W 0402; Manufacturer 1: Samsung Electro-Mechanics; Power (Watts): 0.063W, 1/16W; .Checked SCH: CHK; Category: Resistors; Package / Case: 0402 (1005 Metric); Tolerance: Jumper; Supplier 1: Digi-Key; Supplier Part Number 1: 1276-3480-6-ND; RoHS: RoHS Compliant; Stock 1: 9624698; Pricing 1: 1=0.1, 10=0.016, 25=0.0116, 50=0.009, 100=0.0066, 250=0.005, 500=0.004, 1000=0.00295, 5000=0.00211 (USD); Composition: Thick Film; Features: Moisture Resistant; Temperature Coefficient: -; Size / Dimension: 0.039" L x 0.020" W (1.00mm x 0.50mm); Packaging: Digi-Reel®; ComponentLink1URL: http://www.samsungsem.com/kr/support/product-search/chip-resistor/RC1005J000CS.jsp; ComponentLink1Description: http://www.samsungsem.com/kr/support/product-search/chip-resistor/RC1005J000CS.jsp; Manufacturer Part Number 1: RC1005J000CS; Part Status: Active; Operating Temperature: -55°C ~ 155°C; Supplier Device Package: 0402; Height - Seated (Max): 0.016" (0.40mm); Failure Rate: -; Description 1: RES SMD 0 OHM JUMPER 1/16W 0402
R19 R20 = RC1005F222CS: RES SMD 2.2K OHM 1% 1/16W 0402; Manufacturer 1: Samsung Electro-Mechanics; Power (Watts): 0.063W, 1/16W; .Checked SCH: CHK; Temperature Coefficient: ±100ppm/°C; Category: Resistors; Package / Case: 0402 (1005 Metric); Tolerance: ±1%; Supplier 1: Digi-Key; Supplier Part Number 1: 1276-4046-6-ND; RoHS: RoHS Compliant; Stock 1: 956467; Pricing 1: 1=0.1, 10=0.021, 100=0.0087, 1000=0.00391, 2500=0.00339, 5000=0.0028 (USD); Composition: Thick Film; Features: Moisture Resistant; Size / Dimension: 0.039" L x 0.020" W (1.00mm x 0.50mm); Packaging: Digi-Reel®; ComponentLink1URL: http://www.samsungsem.com/kr/support/product-search/chip-resistor/RC1005F222CS.jsp; ComponentLink1Description: http://www.samsungsem.com/kr/support/product-search/chip-resistor/RC1005F222CS.jsp; Manufacturer Part Number 1: RC1005F222CS; Part Status: Active; Operating Temperature: -55°C ~ 155°C; Supplier Device Package: 0402; Height - Seated (Max): 0.016" (0.40mm); Failure Rate: -; Description 1: RES SMD 2.2K OHM 1% 1/16W 0402
R21 R24 = RC2012F104CS: RES SMD 100K OHM 1% 1/8W 0805; Manufacturer 1: Samsung Electro-Mechanics; Power (Watts): 0.125W, 1/8W; Temperature Coefficient: ±100ppm/°C; .Checked SCH: CHK; Manufacturer Part Number 1: RC2012F104CS; RoHS: RoHS Compliant; Stock 1: 106479; Pricing 1: 1=0.1, 10=0.059, 100=0.024, 1000=0.01079, 2500=0.00936 (USD); Packaging: Digi-Reel®; Part Status: Active; Tolerance: ±1%; Composition: Thick Film; Features: Moisture Resistant; Operating Temperature: -55°C ~ 155°C; Package / Case: 0805 (2012 Metric); Supplier Device Package: 0805; Size / Dimension: 0.079" L x 0.049" W (2.00mm x 1.25mm); Height - Seated (Max): 0.026" (0.65mm); Failure Rate: -; ComponentLink1URL: http://www.samsungsem.com/kr/support/product-search/chip-resistor/RC2012F104CS.jsp; ComponentLink1Description: http://www.samsungsem.com/kr/support/product-search/chip-resistor/RC2012F104CS.jsp; Supplier 1: Digi-Key; Supplier Part Number 1: 1276-3512-6-ND; Description 1: RES SMD 100K OHM 1% 1/8W 0805; Category: Resistors
R22 R23 = CRG0805F4K7: RES SMD 4.7K OHM 1% 1/8W 0805; Manufacturer 1: TE Connectivity Passive Product; Vendor: TE Connectivity; Built_By: EMA_UL_Team; C: Copyright (C) 2015 Accelerated Designs. All rights reserved; Power (Watts): 0.125W, 1/8W; Temperature Coefficient: ±100ppm/°C; .Checked SCH: CHK; Manufacturer_Part_Number: CRG0805F4K7; RefDes: RefDes; Type: DEV; Manufacturer Part Number 1: CRG0805F4K7; RoHS: RoHS Compliant; Stock 1: 28633; Pricing 1: 1=0.1, 10=0.035, 100=0.0143, 1000=0.00641, 2500=0.00557 (USD); Packaging: Cut Tape (CT); Part Status: Active; Tolerance: ±1%; Composition: Thick Film; Features: -; Operating Temperature: -55°C ~ 125°C; Package / Case: 0805 (2012 Metric); Supplier Device Package: 0805; Size / Dimension: 0.079" L x 0.049" W (2.00mm x 1.25mm); Height - Seated (Max): 0.026" (0.65mm); Failure Rate: -; ComponentLink1URL: http://www.te.com/commerce/DocumentDelivery/DDEController?Action=srchrtrv&DocNm=1773204&DocType=DS&DocLang=English; ComponentLink1Description: http://www.te.com/commerce/DocumentDelivery/DDEController?Action=srchrtrv&DocNm=1773204&DocType=DS&DocLang=English; Supplier 1: Digi-Key; Supplier Part Number 1: A106065CT-ND; Description 1: RES SMD 4.7K OHM 1% 1/8W 0805; Category: Resistors
  R22: Value: 4K7
  R23: Value: 4k7
T1 = H5007NL: MODULE SINGLE GIGABIT LAN 24SOIC; Manufacturer: PULSE ELECTRONICS CORPORATION; .Checked PCB: USED; Transformer Type: Isolation and Data Interface (Encapsulated); Turns Ratio - Primary:Secondary: 1CT : 1CT; Category: Transformers; Family: Pulse; Manufacturer Part Number: H5007NL; Operating Temperature: 0°C ~ 70°C; Price 1k [$]: 3.25125; Supplier: Digikey; Supplier Part Number: 553-1334-ND; .Checked SCH: USED; Supplier 1: Digi-Key; Supplier Part Number 1: 553-1334-ND; RoHS: RoHS Compliant; Stock 1: 15654; Pricing 1: 1=5.74, 10=5.1, 100=4.08, 250=3.69752, 500=3.50626, 1000=3.25125, 5000=3.162 (USD); Inductance: -; E.T.: -; Mounting Type: Surface Mount; Size / Dimension: 17.53mm L x 12.20mm W; Height - Seated (Max): 5.76mm; ComponentLink1URL: http://ww2.pulseeng.com/products/datasheets/HC500.pdf; ComponentLink1Description: http://ww2.pulseeng.com/products/datasheets/HC500.pdf
U2-U8 U13 = BAT54S: DIODE ARRAY SCHOTTKY 30V SOT23; Manufacturer 1: Nexperia USA Inc.; Manufacturer Part Number 1: BAT54S,235; Vendor: STMicroelectronics; Built_By: EMA_UL_Team; C: Copyright (C) 2015 Accelerated Designs. All rights reserved; Diode Configuration: 1 Pair Series Connection; Current - Average Rectified (Io) (per Diode): 200mA (DC); Speed: Small Signal =< 200mA (Io), Any Speed; .Checked PCB: USED; Manufacturer_Part_Number: BAT54S; RefDes: RefDes; Type: DEV; Value: Value; RoHS: RoHS Compliant; Stock 1: 7609; Pricing 1: 1=0.23, 10=0.186, 100=0.0986, 500=0.0649, 1000=0.04413 (USD); Packaging: Digi-Reel®; Part Status: Active; Diode Type: Schottky; Operating Temperature - Junction: 150°C (Max); Mounting Type: Surface Mount; Package / Case: TO-236-3, SC-59, SOT-23-3; Supplier Device Package: TO-236AB (SOT23); ComponentLink1URL: https://assets.nexperia.com/documents/data-sheet/BAT54_SER.pdf; ComponentLink1Description: https://assets.nexperia.com/documents/data-sheet/BAT54_SER.pdf; Supplier 1: Digi-Key; Supplier Part Number 1: 1727-1868-6-ND; Description 1: DIODE ARRAY SCHOTTKY 30V SOT23; Category: Discrete Semiconductor Products; .Checked SCH: USED
U9 = SN74LVC1G17DCKR: Manufacturer: Texas Instruments; Built_By: EMA_UL_Team; C: Copyright (C) 2015 Accelerated Designs. All rights reserved; Logic Type: Buffer, Non-Inverting; Number of Bits per Element: 1; Input Type: Schmitt Trigger; Output Type: Push-Pull; Current - Output High, Low: 32mA, 32mA; Voltage - Supply: 1.65 V ~ 5.5 V; Description 1: IC BUF NON-INVERT 5.5V SC70-5; .Checked PCB: USED; Vendor: Texas Instruments; Manufacturer_Part_Number: SN74LVC1G17DCKR; RefDes: RefDes; Type: DEV; Value: Value; Manufacturer 1: Texas Instruments; Manufacturer Part Number 1: SN74LVC1G17DCKR; RoHS: RoHS Compliant; Stock 1: 206797; Pricing 1: 1=0.43, 10=0.32, 100=0.1996, 500=0.13658, 1000=0.10506 (USD); Packaging: Digi-Reel®; Part Status: Active; Operating Temperature: -40°C ~ 125°C (TA); Mounting Type: Surface Mount; Package / Case: 5-TSSOP, SC-70-5, SOT-353; Supplier Device Package: SC-70-5; Base Part Number: 74LVC1G17; ComponentLink1URL: http://www.ti.com/lit/ds/symlink/sn74lvc1g17.pdf; ComponentLink1Description: http://www.ti.com/lit/ds/symlink/sn74lvc1g17.pdf; Supplier 1: Digi-Key; Supplier Part Number 1: 296-11934-6-ND; Category: Integrated Circuits (ICs); .Checked SCH: USED
U10 = SN74LVC244APWR: IC BUF NON-INVERT 3.6V 20TSSOP; Manufacturer: Texas Instruments; Built_By: EMA_UL_Team; C: Copyright (C) 2015 Accelerated Designs. All rights reserved; Logic Type: Buffer, Non-Inverting; Number of Bits per Element: 4; Output Type: 3-State; Current - Output High, Low: 24mA, 24mA; Voltage - Supply: 1.65 V ~ 3.6 V; .Checked PCB: USED; Vendor: Vendor; Manufacturer_Part_Number: SN74LVC244APWR; RefDes: RefDes; Type: DEV; Value: Value; Manufacturer 1: Texas Instruments; Manufacturer Part Number 1: SN74LVC244APWR; RoHS: RoHS Compliant; Stock 1: 67361; Pricing 1: 1=0.47, 10=0.402, 100=0.2999, 500=0.23566, 1000=0.1821 (USD); Packaging: Digi-Reel®; Part Status: Active; Input Type: -; Operating Temperature: -40°C ~ 125°C (TA); Mounting Type: Surface Mount; Package / Case: 20-TSSOP (0.173", 4.40mm Width); Supplier Device Package: 20-TSSOP; Base Part Number: 74LVC244; ComponentLink1URL: http://www.ti.com/lit/ds/symlink/sn74lvc244a.pdf; ComponentLink1Description: http://www.ti.com/lit/ds/symlink/sn74lvc244a.pdf; Supplier 1: Digi-Key; Supplier Part Number 1: 296-1230-6-ND; Description 1: IC BUF NON-INVERT 3.6V 20TSSOP; Category: Integrated Circuits (ICs); .Checked SCH: USED
U11 U12 = TPD4E05U06DQAR: TVS DIODE 5.5V 14V 10SON; Vendor: Texas Instruments; Built_By: EMA_UL_Team; C: Copyright (C) 2016 Accelerated Designs. All rights reserved; Voltage - Reverse Standoff (Typ): 5.5V (Max); Voltage - Breakdown (Min): 6V; Current - Peak Pulse (10/1000µs): 2.5A (8/20µs); Power - Peak Pulse: 40W; Power Line Protection: Yes; .Checked SCH: CHK; Manufacturer_Part_Number: TPD4E05U06DQAR; RefDes: RefDes; Type: DEV; Value: Value; Manufacturer 1: Texas Instruments; Manufacturer Part Number 1: TPD4E05U06DQAR; RoHS: RoHS Compliant; Stock 1: 74653; Pricing 1: 1=0.66, 10=0.578, 100=0.4433, 500=0.3504, 1000=0.28032 (USD); Packaging: Digi-Reel®; Part Status: Active; Voltage - Clamping (Max) @ Ipp: 14V; Applications: HDMI; Capacitance @ Frequency: -; Operating Temperature: -40°C ~ 125°C (TA); Mounting Type: Surface Mount; Package / Case: 10-UFDFN; Supplier Device Package: 10-USON (2.5x1); Base Part Number: TPD4E05U06; ComponentLink1URL: http://www.ti.com/lit/ds/symlink/tpd4e05u06.pdf; ComponentLink1Description: http://www.ti.com/lit/ds/symlink/tpd4e05u06.pdf; Supplier 1: Digi-Key; Supplier Part Number 1: 296-35765-6-ND; Description 1: TVS DIODE 5.5V 14V 10SON; Category: Circuit Protection
U14 = MAX9406ETM+: IC DVI/HDMI LVL SHIFTR 48TQFN; Manufacturer 1: Maxim Integrated; .Checked SCH: CHK; Type: Level Shifter; Manufacturer Part Number 1: MAX9406ETM+; RoHS: RoHS Compliant; Stock 1: 162; Pricing 1: 1=3.75, 10=3.563, 25=2.94, 50=2.793, 250=2.70752, 500=2.44832 (USD); Packaging: Tube; Part Status: Active; Applications: Base Stations; Mounting Type: Surface Mount; Package / Case: 48-WFQFN Exposed Pad; Supplier Device Package: 48-TQFN (7x7); Base Part Number: MAX9406; ComponentLink1URL: https://datasheets.maximintegrated.com/en/ds/MAX9406.pdf; ComponentLink1Description: https://datasheets.maximintegrated.com/en/ds/MAX9406.pdf; Supplier 1: Digi-Key; Supplier Part Number 1: MAX9406ETM+-ND; Description 1: IC DVI/HDMI LVL SHIFTR 48TQFN; Category: Integrated Circuits (ICs)